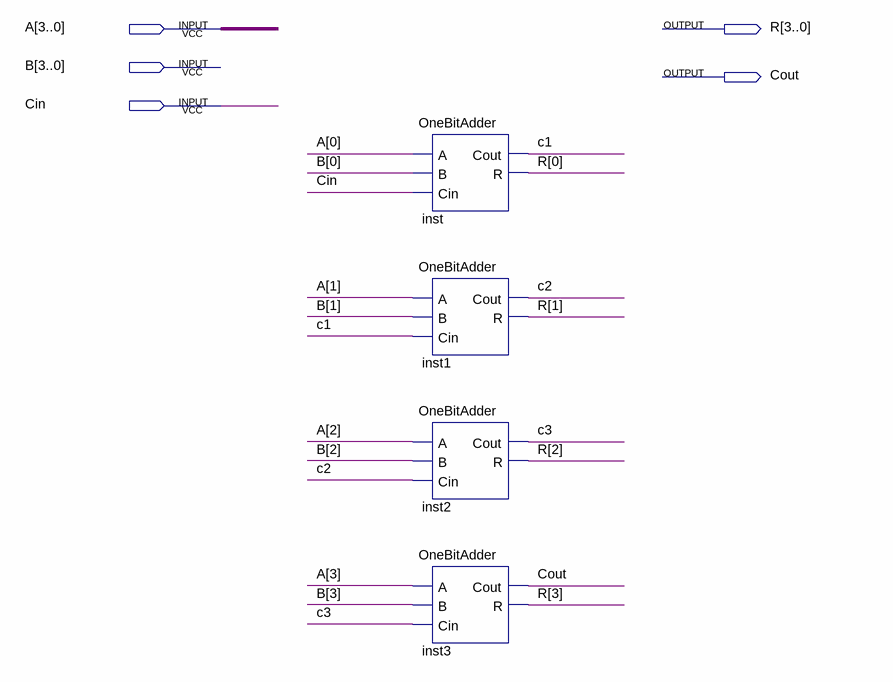
[diagram p0: schematic sheet]
// Quartus schematic FourBitAdder.bdf as structural Verilog: 4 symbols, 5 pins
module FourBitAdder (
  input  [3:0] A,
  input  [3:0] B,
  input  Cin,
  output [3:0] R,
  output Cout
);

  wire c1, c2, c3;

  OneBitAdder inst (.A(A[0]), .B(B[0]), .Cin(Cin), .Cout(c1), .R(R[0]));
  OneBitAdder inst1 (.A(A[1]), .B(B[1]), .Cin(c1), .Cout(c2), .R(R[1]));
  OneBitAdder inst2 (.A(A[2]), .B(B[2]), .Cin(c2), .Cout(c3), .R(R[2]));
  OneBitAdder inst3 (.A(A[3]), .B(B[3]), .Cin(c3), .Cout(Cout), .R(R[3]));
endmodule
